# Altium schematic sheet PortSplitters.SchDoc
size A; Organization: Altium Limited; Address1: L3, 12a Rodborough Rd; Address2: Frenchs Forest; Address3: NSW; Address4: Australia 2086; DocumentNumber: 2; SheetNumber: 2; SheetTotal: 3
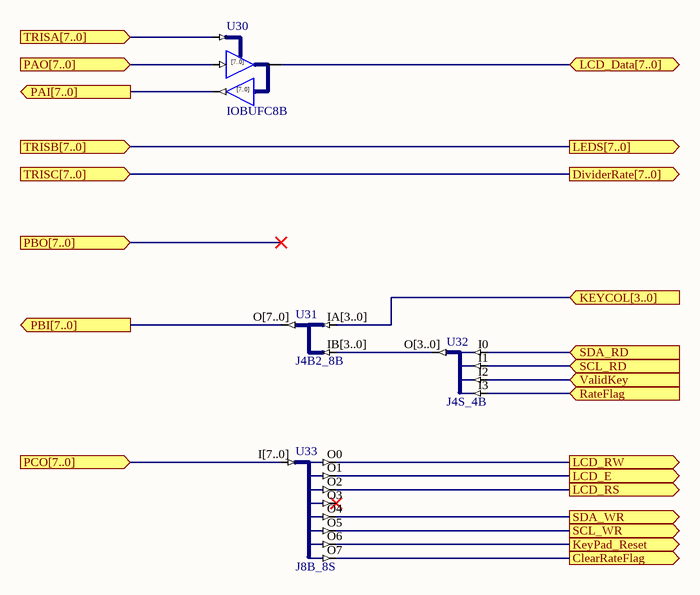
[diagram p0: PortSplitters.SchDoc]

## Parts
U30  IOBUFC8B
U31  J4B2_8B
U32  J4S_4B
U33  J8B_8S

## Ports
ClearRateFlag (out), DividerRate[7..0] (out), KEYCOL[3..0] (in), KeyPad_Reset (out), LCD_Data[7..0] (bidir), LCD_E (out), LCD_RS (out), LCD_RW (out), LEDS[7..0] (out), PAI[7..0] (out), PAO[7..0] (in), PBI[7..0] (out), PBO[7..0] (in), PCO[7..0] (in), RateFlag (in), SCL_RD (in), SCL_WR (out), SDA_RD (in), SDA_WR (out), TRISA[7..0] (in), TRISB[7..0] (in), TRISC[7..0] (in), ValidKey (in)

## Nets
ClearRateFlag: U33.O7 ; port ClearRateFlag
KEYCOL[3..0]: U31.IA[3..0] ; port KEYCOL[3..0]
KeyPad_Reset: U33.O6 ; port KeyPad_Reset
LCD_Data[7..0]: U30.IO[7..0] ; port LCD_Data[7..0]
LCD_E: U33.O1 ; port LCD_E
LCD_RS: U33.O2 ; port LCD_RS
LCD_RW: U33.O0 ; port LCD_RW
PAI[7..0]: U30.O[7..0] ; port PAI[7..0]
PAO[7..0]: U30.I[7..0] ; port PAO[7..0]
PBI[7..0]: U31.O[7..0] ; port PBI[7..0]
PCO[7..0]: U33.I[7..0] ; port PCO[7..0]
RateFlag: U32.I3 ; port RateFlag
SCL_RD: U32.I1 ; port SCL_RD
SCL_WR: U33.O5 ; port SCL_WR
SDA_RD: U32.I0 ; port SDA_RD
SDA_WR: U33.O4 ; port SDA_WR
TRISA[7..0]: U30.T[7..0] ; port TRISA[7..0]
ValidKey: U32.I2 ; port ValidKey
NetU31_IB[3..0]: U31.IB[3..0] U32.O[3..0]

Not connected (* = marked no-connect by the designer): U33 O3*

## Buses and harness runs
bus port DividerRate[7..0] = port TRISC[7..0]
bus port LEDS[7..0] = port TRISB[7..0]

## Notes on the sheet
- Title
- Size:
- Date:
- A
- Number:
- Time:
- Revision:
- Sheet
- of
- File:
- (in symbol IOBUFC8B) [7..0]

## Library data of the parts
U30 = IOBUFC8B: 8-Bit Input/Output Buffer With Separated Control, Bus Version; ArchiveName: GENERIC; Published: 18-Nov-2003; Publisher: Altium Limited; Core Revision: 1.00.00
U31 = J4B2_8B: 2 x 4-Bit input bus to 1 x 8-bit output bus; ArchiveName: GENERIC; Published: 18-Nov-2003; Publisher: Altium Limited; Core Revision: 1.00.00
U32 = J4S_4B: 4 Single pin inputs to single 4-Bit output bus; ArchiveName: GENERIC; Published: 18-Nov-2003; Publisher: Altium Limited; Core Revision: 1.00.00
U33 = J8B_8S: 8-Bit input bus to 8 single pin outputs; ArchiveName: GENERIC; Published: 18-Nov-2003; Publisher: Altium Limited; Core Revision: 1.00.00